# EAGLE design Lower_board (EAGLE 7.2.0)
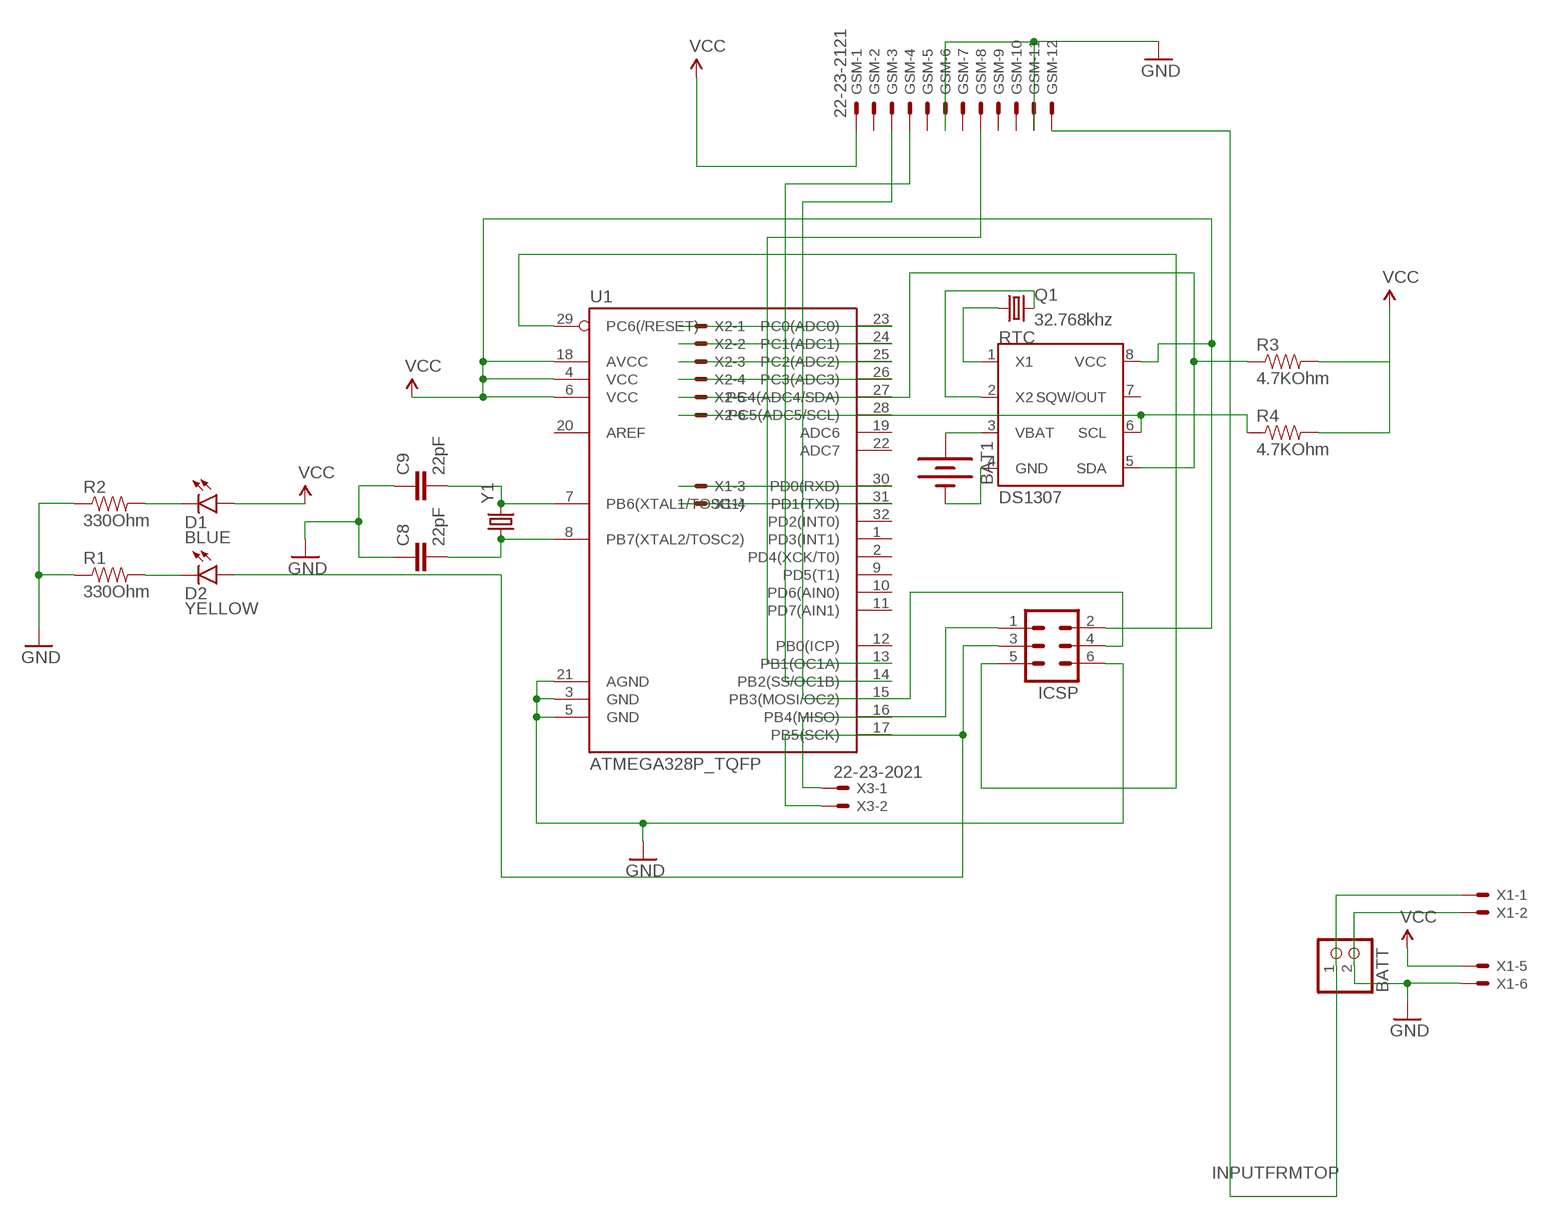
[diagram p0: schematic, sheet 1]

## Parts
BAT1  BATTERY20PTH  [BATTCOM_20MM_PTH]
BATT  JST_2PIN-SMT-RA  [JST-PH-2-SMT-RA]
C8  22pF  CAP0603-CAP  [0603-CAP]
C9  22pF  CAP0603-CAP  [0603-CAP]
D1  BLUE  LED-BLUE1206  [LED-1206]
D2  YELLOW  LED-YELLOWLARGE  [LED-1206]
GSM  22-23-2121  [22-23-2121]
ICSP  ML6  [ML6]
Q1  32.768khz  CRYSTALTXC-7A  [CRYSTAL-TXC-7A]
R1  330Ohm  RESISTOR1206  [1206]
R2  330Ohm  RESISTOR1206  [1206]
R3  4.7KOhm  RESISTOR1206  [1206]
R4  4.7KOhm  RESISTOR1206  [1206]
RTC  DS1307  [SOIC-8]
U1  ATMEGA328P_TQFP  [TQFP32-08]
X1  22-23-2061  [22-23-2061]
X2  22-23-2061  [22-23-2061]
X3  22-23-2021  [22-23-2021]
Y1  CRYSTALTXC-7A  [CRYSTAL-TXC-7A]

## Nets
GND: BATT.2 C8.1 C9.1 GSM.6 GSM.11 ICSP.6 R1.1 R2.1 U1.3(GND) U1.5(GND) U1.21(AGND) X1.2 X1.6
INPUTFRMTOP: BATT.1 GSM.12 X1.1
N$1: BAT1.1(+) RTC.3(VBAT)
N$2: BAT1.2(-) RTC.4(GND)
N$3: Q1.P$1 RTC.1(X1)
N$4: ICSP.1 U1.16(PB4(MISO)) X3.1
N$5: ICSP.5 U1.29(PC6(/RESET))
N$6: D2.A ICSP.3 X3.2
N$7: Q1.P$2 RTC.2(X2)
N$8: R4.1 RTC.6(SCL) U1.28(PC5(ADC5/SCL)) X2.6
N$9: GSM.4 U1.14(PB2(SS/OC1B))
N$10: GSM.3 ICSP.4 U1.15(PB3(MOSI/OC2))
N$11: D1.C R2.2
N$12: D2.C R1.2
N$13: GSM.8 U1.13(PB1(OC1A))
N$14: R3.1 RTC.5(SDA) U1.27(PC4(ADC4/SDA)) X2.5
N$15: U1.23(PC0(ADC0)) X2.1
N$20: U1.24(PC1(ADC1)) X2.2
N$24: U1.25(PC2(ADC2)) X2.3
N$26: U1.26(PC3(ADC3)) X2.4
N$28: U1.30(PD0(RXD)) X1.3
N$29: U1.31(PD1(TXD)) X1.4
N$31: C9.2 U1.7(PB6(XTAL1/TOSC1)) Y1.P$2
N$32: C8.2 U1.8(PB7(XTAL2/TOSC2)) Y1.P$1
VCC: D1.A GSM.1 ICSP.2 R3.2 R4.2 RTC.8(VCC) U1.4(VCC) U1.6(VCC) U1.18(AVCC) X1.5
Unconnected: GSM.2 GSM.5 GSM.7 GSM.9 GSM.10 RTC.7(SQW/OUT) U1.1(PD3(INT1)) U1.2(PD4(XCK/T0)) U1.9(PD5(T1)) U1.10(PD6(AIN0)) U1.11(PD7(AIN1)) U1.12(PB0(ICP)) U1.17(PB5(SCK)) U1.19(ADC6) U1.20(AREF) U1.22(ADC7) U1.32(PD2(INT0))

## Library data of the parts
BAT1 = SparkFun:BATTERY: Battery Holders Various common sizes : AA, AAA, 20mm coin cell and 12mm coin cell.
BATT = adafruit:JST_2PIN: JST 2-Pin Connectors of various flavors SMT-RA (S2B-PH-SM4) 4UConnector #17311 SMT (B2B-PH-SM4) THM-RA (S2B-PH) THM (B2B-PH)
C8 C9 = SparkFun:CAP: Capacitor Standard 0603 ceramic capacitor, and 0.1" leaded capacitor.
D1 = SparkFun-LED:LED-BLUE: Blue LEDs for production use Various blue LEDs stocked by SparkFun production 0603 - DIO-08575 Rebel - DIO-09553 1206 - DIO-09911; PROD_ID: DIO-09911
D2 = SparkFun-LED:LED-YELLOW: Yellow SMD LEDs LilyPad 1206- DIO-09909 0603- DIO-09003; PROD_ID: DIO-00820
GSM = con-molex:22-23-2121: .100" (2.54mm) Center Header - 12 Pin; MF: MOLEX; MPN: 22-23-2121; OC_FARNELL: 1462935; OC_NEWARK: 56H0456
ICSP = con-harting-ml:ML6: HARTING; OC_FARNELL: unknown; OC_NEWARK: unknown
Q1 Y1 = SparkFun-FreqCtrl:CRYSTAL: Various standard crystals. Proven footprints.
R1-R4 = SparkFun-Resistors:RESISTOR: Resistor Basic schematic elements and footprints for 0603, 1206, and PTH resistors.
RTC = dallas:DS1307: I2C Serial RTC w/56 bytes battery backed RAM
U1 = SparkFun-DigitalIC:ATMEGA328P_TQFP; PROD_ID: IC-09069
X1 X2 = con-molex:22-23-2061: .100" (2.54mm) Center Header - 6 Pin; MF: MOLEX; MPN: 22-23-2061; OC_FARNELL: 1462922; OC_NEWARK: 27C1933
X3 = con-molex:22-23-2021: .100" (2.54mm) Center Header - 2 Pin; MF: MOLEX; MPN: 22-23-2021; OC_FARNELL: 1462926; OC_NEWARK: 25C3832

## Board
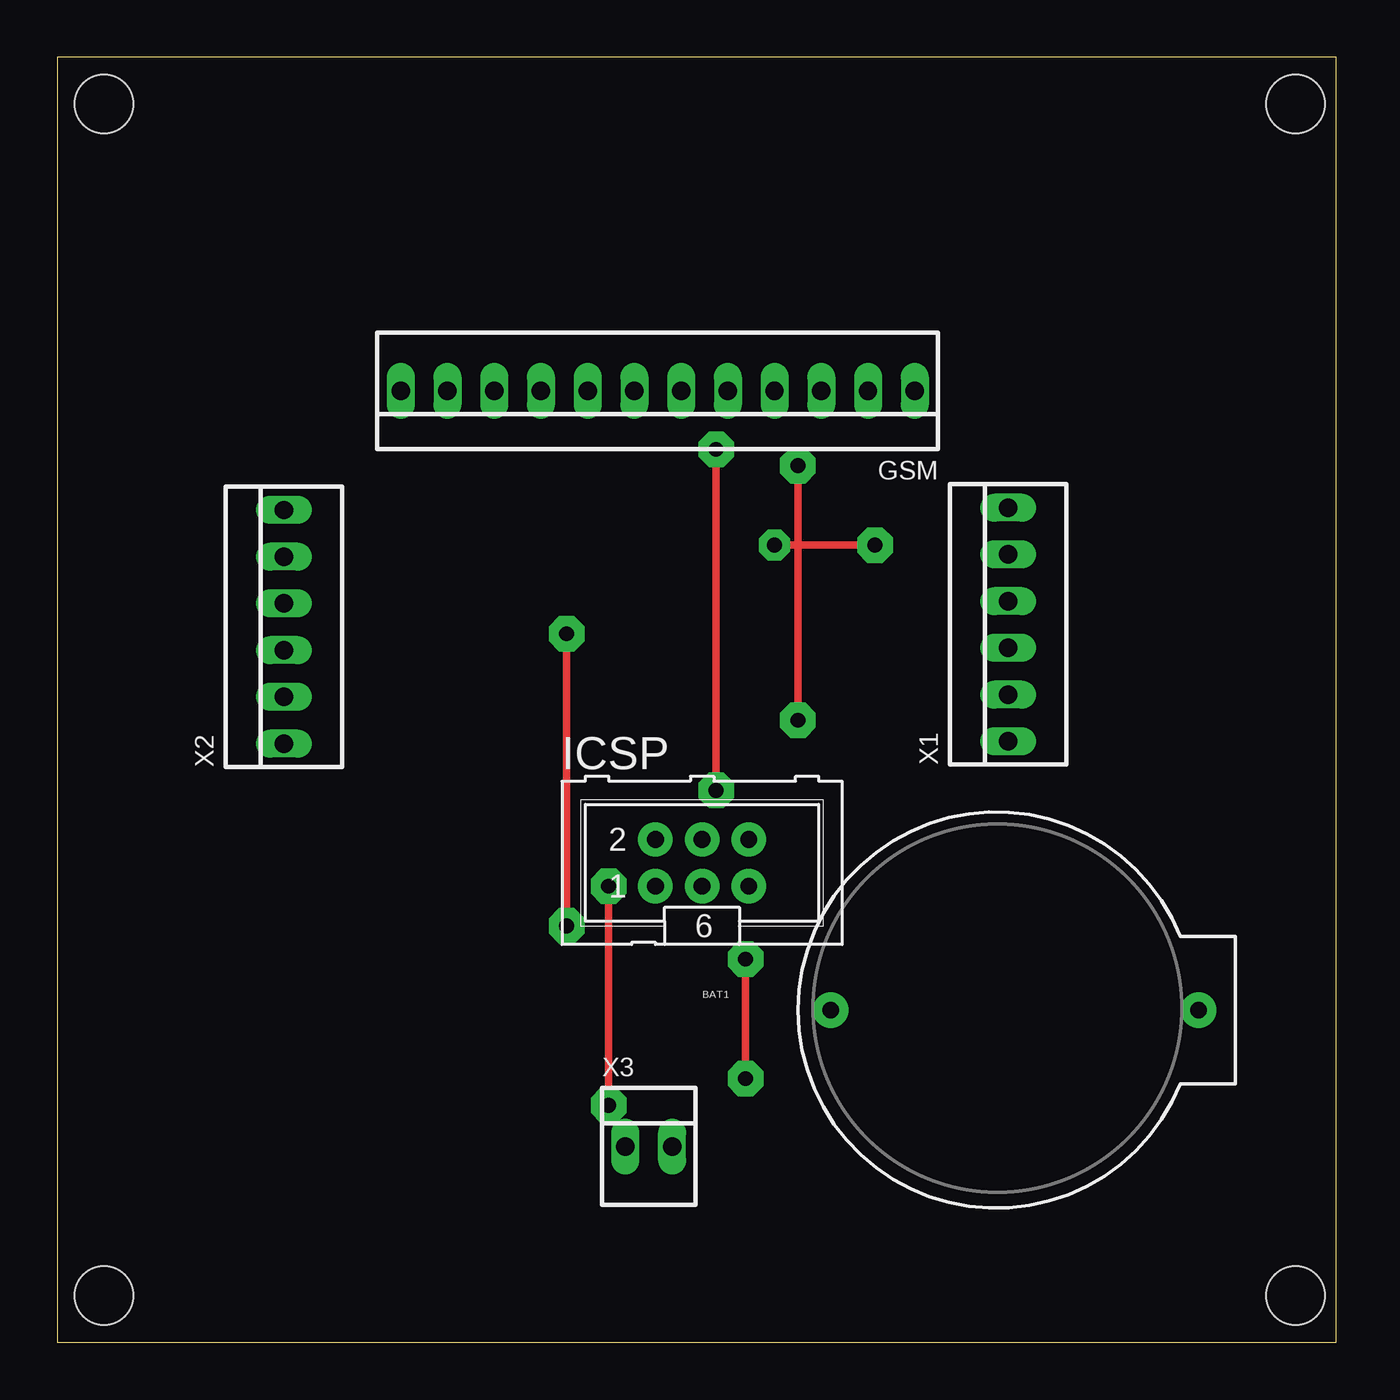
[diagram p1: board, top side]
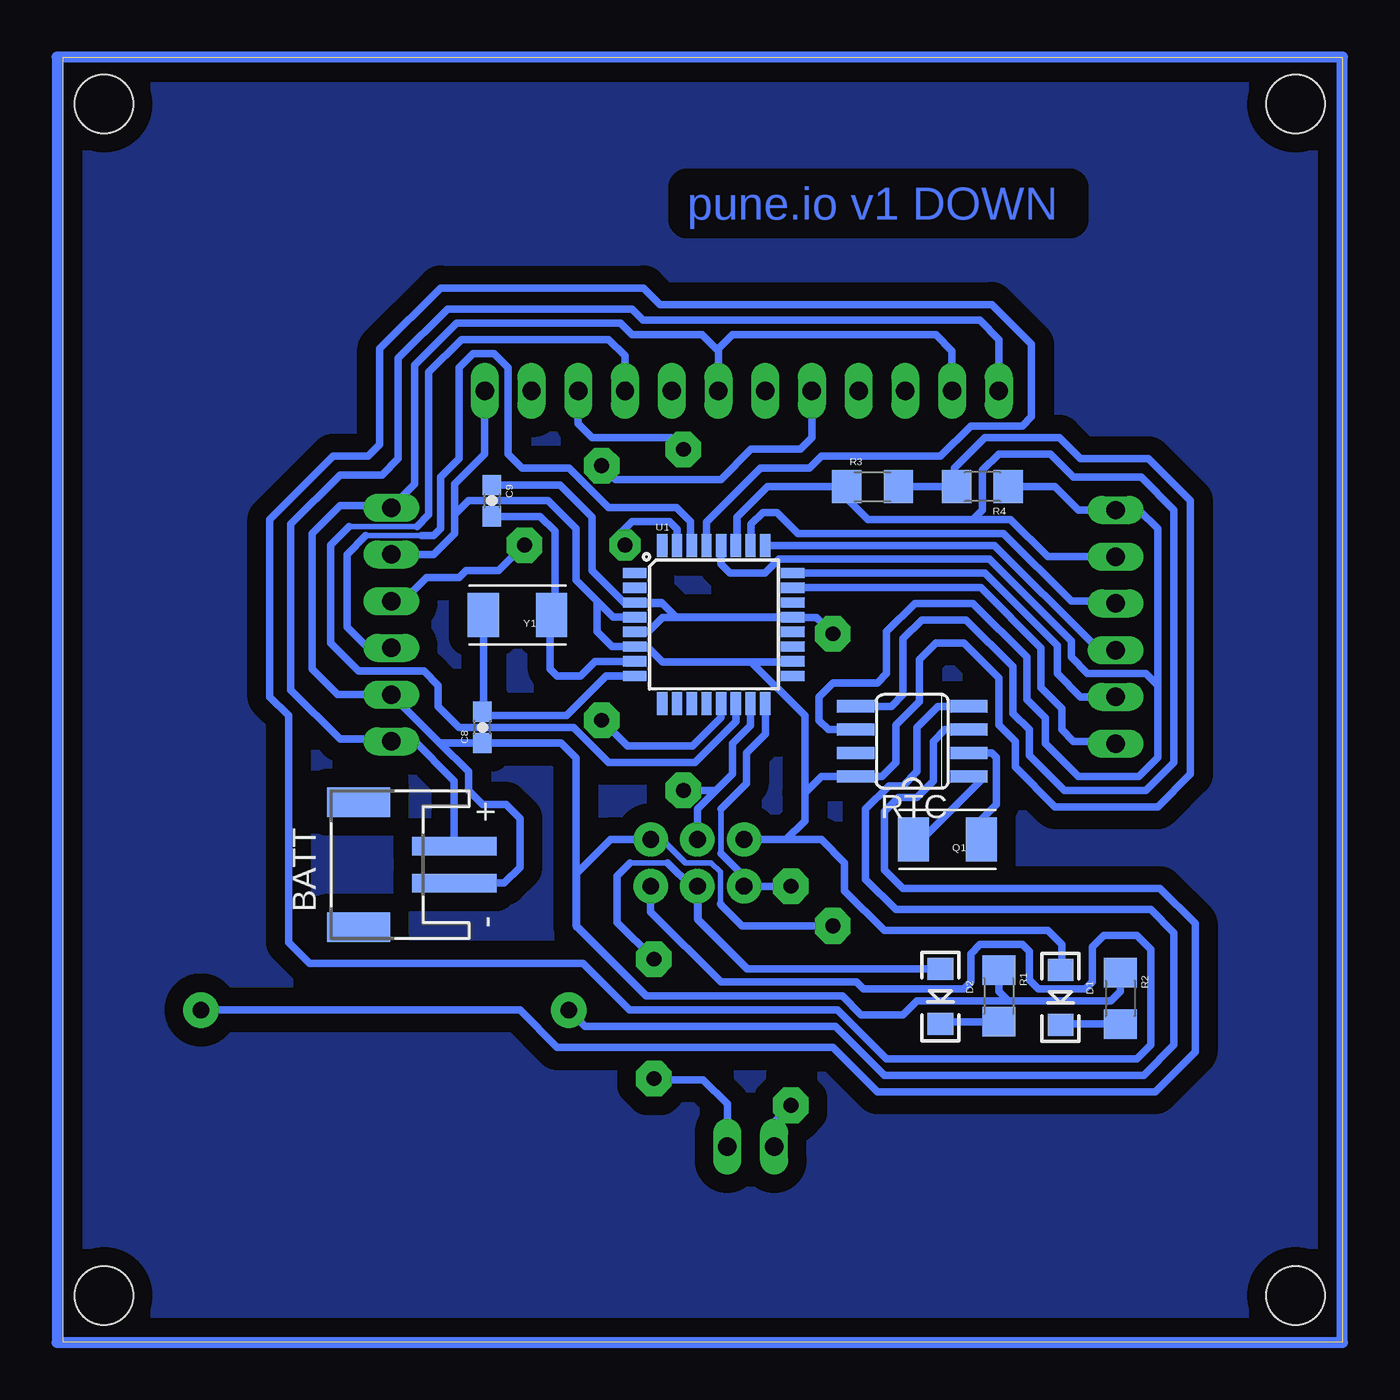
[diagram p2: board, bottom side, seen from below]

Size 69.52 x 69.84 mm. Coordinates in mm from the lower left corner, seen from the top.
Outline: 0,0 69.52,0 69.52,69.84 0,69.84 0,0
Copper layers (1*16): Top 0.035mm / dielectric 1.5mm / Bottom 0.035mm
Design rules "default": minimum track width 10mil, minimum drill 24mil, track to track 8mil, track to pad 8mil, pad to pad 8mil, via to via 8mil, smd to smd 8mil, copper to edge 40mil, drill to drill 8mil, minimum pad ring 10mil, minimum via ring 8mil, stop-mask expansion 4mil, vias tented up to drill 0mil, thermal gap 10mil
Holes 3.2 mm at 2.54,67.31 67.31,67.31 67.31,2.54 2.54,2.54

### Footprints (pad centres in the part's own frame; a part is rotated, then mirrored left to right if it is on the bottom)
BATTCOM_20MM_PTH = drill 0.9 pad 1.93: 1 20,0; 2 0,0
JST-PH-2-SMT-RA = smd 1 x 4.6: 1 1,-3.7; 2 -1,-3.7 | smd 1.6 x 3.4: NC1 -3.4,1.5; NC2 3.4,1.5
0603-CAP = smd 1.1 x 1: 1 -0.85,0; 2 0.85,0
LED-1206 = smd 1.2 x 1.4: A -1.5,0; C 1.5,0
22-23-2121 = drill 1 long: 1 -13.97,0; 2 -11.43,0; 3 -8.89,0; 4 -6.35,0; 5 -3.81,0; 6 -1.27,0; 7 1.27,0; 8 3.81,0; 9 6.35,0; 10 8.89,0; 11 11.43,0; 12 13.97,0
ML6 = drill 0.914 pad 1.87: 1 -2.54,-1.27; 2 -2.54,1.27; 3 0,-1.27; 4 0,1.27; 5 2.54,-1.27; 6 2.54,1.27
CRYSTAL-TXC-7A = smd 1.7 x 2.4: P$1 1.85,0; P$2 -1.85,0
1206 = smd 1.6 x 1.8: 1 -1.4,0; 2 1.4,0
SOIC-8 = smd 2.032 x 0.66: 1 -3.073,1.27; 2 -3.073,0; 3 -3.073,-1.27; 4 -3.073,-2.54; 5 3.073,-2.54; 6 3.073,-1.27; 7 3.073,0; 8 3.073,1.27
TQFP32-08 = smd 1.27 x 0.559: 1 -4.293,2.8; 2 -4.293,2; 3 -4.293,1.2; 4 -4.293,0.4; 5 -4.293,-0.4; 6 -4.293,-1.2; 7 -4.293,-2; 8 -4.293,-2.8; 17 4.293,-2.8; 18 4.293,-2; 19 4.293,-1.2; 20 4.293,-0.4; 21 4.293,0.4; 22 4.293,1.2; 23 4.293,2; 24 4.293,2.8 | smd 0.559 x 1.27: 9 -2.8,-4.293; 10 -2,-4.293; 11 -1.2,-4.293; 12 -0.4,-4.293; 13 0.4,-4.293; 14 1.2,-4.293; 15 2,-4.293; 16 2.8,-4.293; 25 2.8,4.293; 26 2,4.293; 27 1.2,4.293; 28 0.4,4.293; 29 -0.4,4.293; 30 -1.2,4.293; 31 -2,4.293; 32 -2.8,4.293
22-23-2061 = drill 1 long: 1 -6.35,0; 2 -3.81,0; 3 -1.27,0; 4 1.27,0; 5 3.81,0; 6 6.35,0
22-23-2021 = drill 1 long: 1 -1.27,0; 2 1.27,0

### Placement (x,y rotation side)
BAT1  42.04,18.06 0 top
BATT  51.97,25.96 90 bottom
C8  46.74,33.43 90 bottom
C9  46.23,45.75 270 bottom
D1  15.32,18.75 270 bottom
D2  21.84,18.8 270 bottom
GSM  32.64,51.71 180 top
ICSP  35.05,26.06 0 top
Q1  21.46,27.33 180 bottom
R1  18.67,18.82 270 bottom
R2  12.06,18.69 270 bottom
R3  25.53,46.51 0 bottom
R4  19.56,46.51 180 bottom
RTC  23.37,32.03 180 bottom
U1  34.16,39.01 0 bottom
X1  51.69,39.01 90 top
X2  12.32,38.89 90 top
X3  32.16,10.64 0 top
Y1  44.83,39.52 180 bottom

### Tracks (layer width: path | path; a pad name or v marks a point on that pad's centre or on a via)
GND  (via drill 0.8 pad 1.93)
  Top 0.406: v27.69,38.51 v27.69,22.63
  Bottom 0.305: 33.81,23.82 33.81,25.55 34.31,26.06 35.71,26.06 36.93,27.28
  Bottom 0.406: 51.69,45.45 X1.6 | 51.6,35.12 X1.2 | 49.06,32.58 X1.2 | 39.05,40.21 U1.3 37.01,40.21 36.96,40.16 | GSM.11 21.21,53.87 22.1,54.76 33.15,54.76 33.91,54 GSM.6 33.91,53.87 34.8,54.76 38.61,54.76 39.24,55.4 48.13,55.4 50.42,53.11 50.42,46.63 X1.6 | X1.2 54.61,35.2 56.01,36.6 56.01,43.97 54.48,45.49 51.82,45.49 X1.6 | BATT.2 45.55,24.96 44.7,25.81 44.7,28.47 45.47,29.23 46.74,29.23 47.5,30 47.5,31.01 49.06,32.58 | 49.06,32.58 C8.1 42.47,32.58 41.66,31.76 41.66,22.66 37.82,18.82 | R2.1 12.06,19.07 12.57,18.57 18.16,18.57 | R1.1 18.67,19.07 18.16,18.57 | 37.82,18.82 27.18,18.82 26.16,17.8 23.88,17.8 23.11,18.57 18.16,18.57 | 39.05,40.21 38.99,40.16 36.96,40.16 | U1.21 36.07,39.41 | 36.07,39.41 36.21,39.41 36.32,39.52 | U1.5 37.74,38.61 36.96,39.4 36.32,39.4 | 36.32,39.4 36.09,39.4 | 36.09,39.4 36.07,39.41 | C9.1 42.51,46.59 40.77,44.86 40.77,41.94 39.05,40.21 | 36.96,40.16 36.32,39.52 | 36.32,39.52 36.32,39.4 | 36.09,39.4 28.57,39.4 v27.69,38.51 | v27.69,22.63 32.64,22.63 33.76,23.75 33.76,23.77 33.81,23.82 | 36.93,27.28 37.54,27.28 ICSP.6 39.78,27.33 41.63,25.48 41.63,22.61 | 37.82,18.82 37.85,18.82 41.63,22.61 | 41.63,22.61 41.63,22.58
INPUTFRMTOP
  Bottom 0.406: BATT.1 48.27,30.51 50.55,32.79 51.56,32.79 X1.1 51.82,32.79 54.48,32.79 57.15,35.46 57.15,44.48 54.48,47.14 52.2,47.14 51.31,48.03 51.31,53.49 48.64,56.16 38.61,56.16 38,55.55 19.71,55.55 18.67,54.51 GSM.12
N$1
  Bottom 0.406: RTC.3 21.59,33.3 22.23,32.66 22.23,30.5 23.11,29.62 24.13,29.62 24.89,28.85 24.89,25.68 23.88,24.66 9.91,24.66 8,22.76 8,15.77 10.16,13.61 25.27,13.61 27.69,16.03 42.67,16.03 44.7,18.06 BAT1.1
N$2
  Bottom 0.406: RTC.4 21.97,34.57 23.11,33.43 23.11,31.01 23.88,30.25 24.64,30.25 25.91,28.98 25.91,25.17 24.26,23.52 10.41,23.52 9.14,22.25 9.14,16.15 10.79,14.5 24.89,14.5 27.56,17.17 41.15,17.17 BAT1.2
N$3
  Bottom 0.406: Q1.P$1 22.86,27.33 19.56,30.63 20.17,30.63 RTC.1
N$4  (via drill 0.8 pad 1.93)
  Top 0.406: v29.97,24.79 v29.97,12.88
  Bottom 0.305: 33.78,26.57 33.78,28.98
  Bottom 0.406: 33.78,28.98 32.38,30.38 32.38,32.03 31.36,33.05 U1.16 | 33.78,26.57 32.64,25.43 32.64,24.79 ICSP.1 v29.97,24.79 29.95,24.82 | X3.1 30.89,11.96 v29.97,12.88
N$5
  Bottom 0.406: ICSP.5 37.59,23.39 33.78,19.58 26.42,19.58 26.04,19.2 20.57,19.2 20.19,19.58 20.19,21.11 19.68,21.61 17.4,21.61 17.02,21.23 17.02,19.71 16.51,19.2 13.97,19.2 13.59,19.58 13.59,21.49 12.95,22.12 11.18,22.12 10.41,21.36 10.41,16.15 11.18,15.39 24.77,15.39 27.43,18.06 38.73,18.06 41.27,20.6 56.13,20.6 57.28,21.74 57.28,34.06 58.29,35.08 58.29,44.73 54.86,48.16 52.96,48.16 52.32,48.79 52.32,54 49.02,57.3 37.97,57.3 37.08,56.41 19.05,56.41 16.89,54.25 16.89,50.32 17.4,49.81 20.19,49.81 21.84,48.16 28.32,48.16 28.96,47.52 31.62,47.52 34.56,44.58 U1.29
N$6  (via drill 0.8 pad 1.93)
  Top 0.406: v37.41,20.83 v37.41,14.33
  Bottom 0.305: 36.68,26.06 38.71,26.06
  Bottom 0.406: D2.A 32.34,20.3 | 32.34,20.3 35.05,23.01 35.05,24.77 | 35.05,24.77 ICSP.3 | 32.34,20.3 32.36,20.3 35.03,22.96 35.03,24.74 35.05,24.77 | 35.05,24.77 35.38,24.77 36.68,26.06 | 38.71,26.06 39.42,25.35 39.42,22.84 v37.41,20.83 | X3.2 33.43,12.95 34.75,14.28 37.47,14.28 v37.41,14.33
N$7
  Bottom 0.406: RTC.2 19.05,32.03 18.8,31.77 18.8,29.23 19.81,28.22 19.81,27.53 Q1.P$2
N$8
  Bottom 0.406: R4.1 15.62,46.51 14.35,45.24 X2.6 11.05,45.24 10.03,44.22 10.03,35.71 | 10.03,35.71 10.03,31.77 11.05,30.76 14.35,30.76 16.13,32.54 16.13,33.93 17.14,34.95 17.14,37.24 20.07,40.16 23.24,40.16 24.77,38.63 24.77,36.35 25.27,35.84 27.69,35.84 28.45,35.08 28.45,33.81 27.94,33.3 RTC.6 | U1.28 33.76,42.3 33.27,41.81 31.37,41.81 30.61,42.57 19.18,42.57 14.73,38.12 14.73,37.24 13.84,36.35 10.67,36.35 10.03,35.71
N$9
  Bottom 0.305: 53.98,44.35 50.29,44.35
  Bottom 0.406: U1.14 32.96,33.74 35.18,31.52 39.88,31.52 41.78,33.43 48.01,33.43 49.15,34.57 49.15,35.71 49.91,36.47 53.47,36.47 54.99,38 54.99,43.33 53.98,44.35 | 50.29,44.35 49.66,44.98 49.66,52.73 47.88,54.51 39.88,54.51 38.99,53.62 GSM.4
N$10  (via drill 0.8 pad 1.93)
  Top 0.406: v35.81,48.54 v35.81,30
  Bottom 0.406: ICSP.4 35.05,28.98 34.04,30 | U1.15 32.16,33.52 33.15,32.54 33.15,30.89 34.04,30 | GSM.3 41.53,49.94 40.77,49.17 36.45,49.17 v35.81,48.54 | 34.04,30 v35.81,30
N$11
  Bottom 0.406: R2.2 15.27,17.29 D1.C
N$12
  Bottom 0.406: R1.2 21.72,17.42 D2.C
N$13  (via drill 0.8 pad 1.93)
  Top 0.406: v40.26,47.65 v40.26,33.81
  Bottom 0.406: 28.83,51.33 GSM.8 28.83,49.17 29.46,48.54 32.13,48.54 33.78,46.89 39.5,46.89 v40.26,47.65 | U1.13 33.76,33.95 35.31,32.41 38.86,32.41 v40.26,33.81
N$14
  Bottom 0.406: 20.07,44.73 18.03,44.73 16,42.7 X2.5 | 20.07,44.73 25.78,44.73 26.92,45.87 R3.1 31.24,46.51 32.89,44.86 32.89,43.38 U1.27 | RTC.5 24.51,34.57 23.88,35.2 23.88,38.25 22.86,39.27 20.45,39.27 17.91,36.73 17.91,34.19 17.02,33.3 17.02,31.9 15.11,30 10.67,30 9.14,31.52 9.14,45.24 10.92,47.02 14.61,47.02 15.88,48.28 18.67,48.28 19.56,47.4 19.56,45.24 20.07,44.73
N$15
  Bottom 0.406: U1.23 19.65,41.01 16.38,37.74 16.38,35.59 15.24,34.44 15.24,33.3 14.61,32.66 12.45,32.66 X2.1
N$16
  Bottom 0.61: 0,69.85 69.85,69.85 69.85,0 0,0 0,69.85
N$17
  pour Bottom (isolate 1.016): 1.27,68.58 68.58,68.58 68.58,1.27 1.27,1.27
N$20
  Bottom 0.406: U1.24 19.44,41.81 15.49,37.87 15.49,36.35 14.22,35.08 X2.2
N$24
  Bottom 0.406: X2.3 13.08,37.62 13.46,38 13.59,38 18.9,43.31 U1.25
N$26
  Bottom 0.406: U1.26 32.13,43.34 32.13,44.48 31.5,45.11 30.73,45.11 29.59,43.97 18.41,43.97 14.73,40.28 12.45,40.28 X2.4
N$28
  Bottom 0.305: 53.09,43.84 50.04,43.84
  Bottom 0.406: U1.30 35.43,43.38 35.43,44.6 36.2,45.36 39.88,45.36 42.04,47.52 44.58,47.52 45.34,48.28 45.34,52.98 46.1,53.75 47.24,53.75 48.01,52.98 48.01,48.03 49.02,47.02 49.02,44.22 49.4,43.84 50.04,43.84 | X1.3 52.96,37.74 54.1,38.89 54.1,42.82 53.09,43.84
N$29  (via drill 0.8 pad 1.68, 0.8 pad 1.93)
  Top 0.406: v44.45,43.33 v38.99,43.33
  Bottom 0.406: X1.4 51.05,40.28 49.78,41.55 48.01,41.55 47.62,41.94 45.85,41.94 v44.45,43.33 | U1.31 36.16,44.19 36.58,44.6 38.61,44.6 39.12,44.09 39.12,43.46 v38.99,43.33
N$31
  Bottom 0.406: U1.7 40.61,37.01 41.4,36.22 42.67,36.22 43.05,36.6 43.05,39.45 Y1.P$2 42.8,39.7 42.8,44.09 43.6,44.9 C9.2
N$32
  Bottom 0.406: 46.48,40.36 Y1.P$1 46.68,34.33 C8.2 46.52,34.06 42.16,34.06 40.01,36.21 U1.8
VCC
  Bottom 0.406: GSM.1 46.61,48.28 48.26,46.63 48.26,44.98 | 48.26,44.98 48.26,43.97 49.4,42.82 X1.5 | 40.51,40.28 40.51,38.63 39.69,37.81 U1.6 37.79,37.81 36.96,36.98 32.13,36.98 | 48.26,44.98 47.5,45.74 43.18,45.74 41.66,44.22 41.66,41.43 40.51,40.28 | 29.84,36.98 U1.18 29.9,36.98 32.13,36.98 | 20.96,46.76 R4.2 R3.2 21.21,46.51 21.08,46.63 21.08,47.52 19.43,49.17 15.37,49.17 14.22,48.03 10.54,48.03 8.26,45.74 8.26,30.89 10.03,29.11 15.62,29.11 17.78,31.27 17.78,32.66 18.67,33.55 18.67,36.09 20.57,38 22.1,38 22.99,37.11 22.99,34.82 24.26,33.55 24.26,31.52 25.02,30.76 RTC.8 28.32,30.76 29.21,29.87 | 29.21,29.87 29.21,28.35 30.23,27.33 | 30.23,27.33 ICSP.2 | 15.32,20.68 D1.A 15.24,20.32 15.24,21.61 16,22.38 24.89,22.38 27.05,24.54 27.05,26.06 28.32,27.33 30.23,27.33 | U1.4 39.64,39.41 40.51,40.28 | 32.13,36.98 29.21,34.06 29.21,29.87

### Text on the board
Bottom: pune.io v1 DOWN